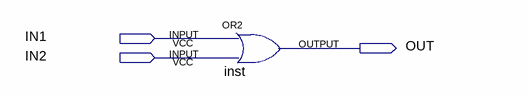
[diagram p0: schematic sheet]
// Quartus schematic testt6.bdf as structural Verilog: 1 symbols, 3 pins
module testt6 (
  input  IN1,
  input  IN2,
  output OUT
);

  or inst (OUT, IN1, IN2);
endmodule
